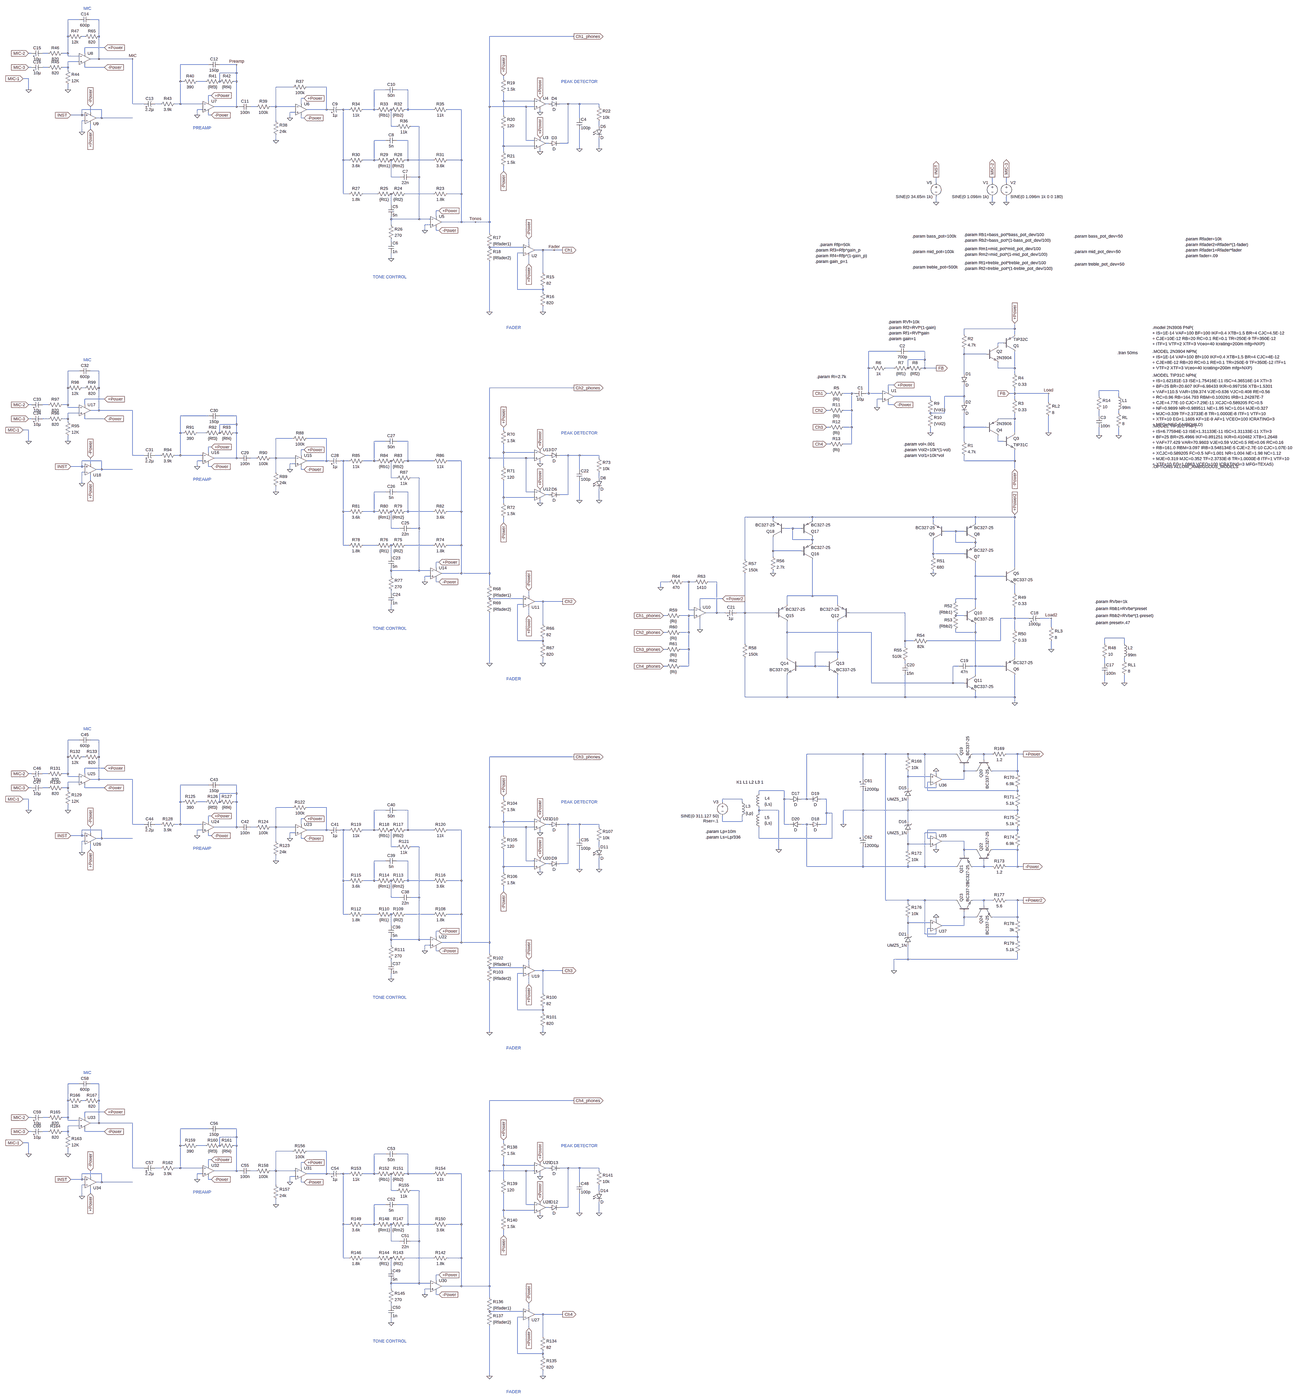
[diagram p0: schematic Project with supply.asc, whole sheet]
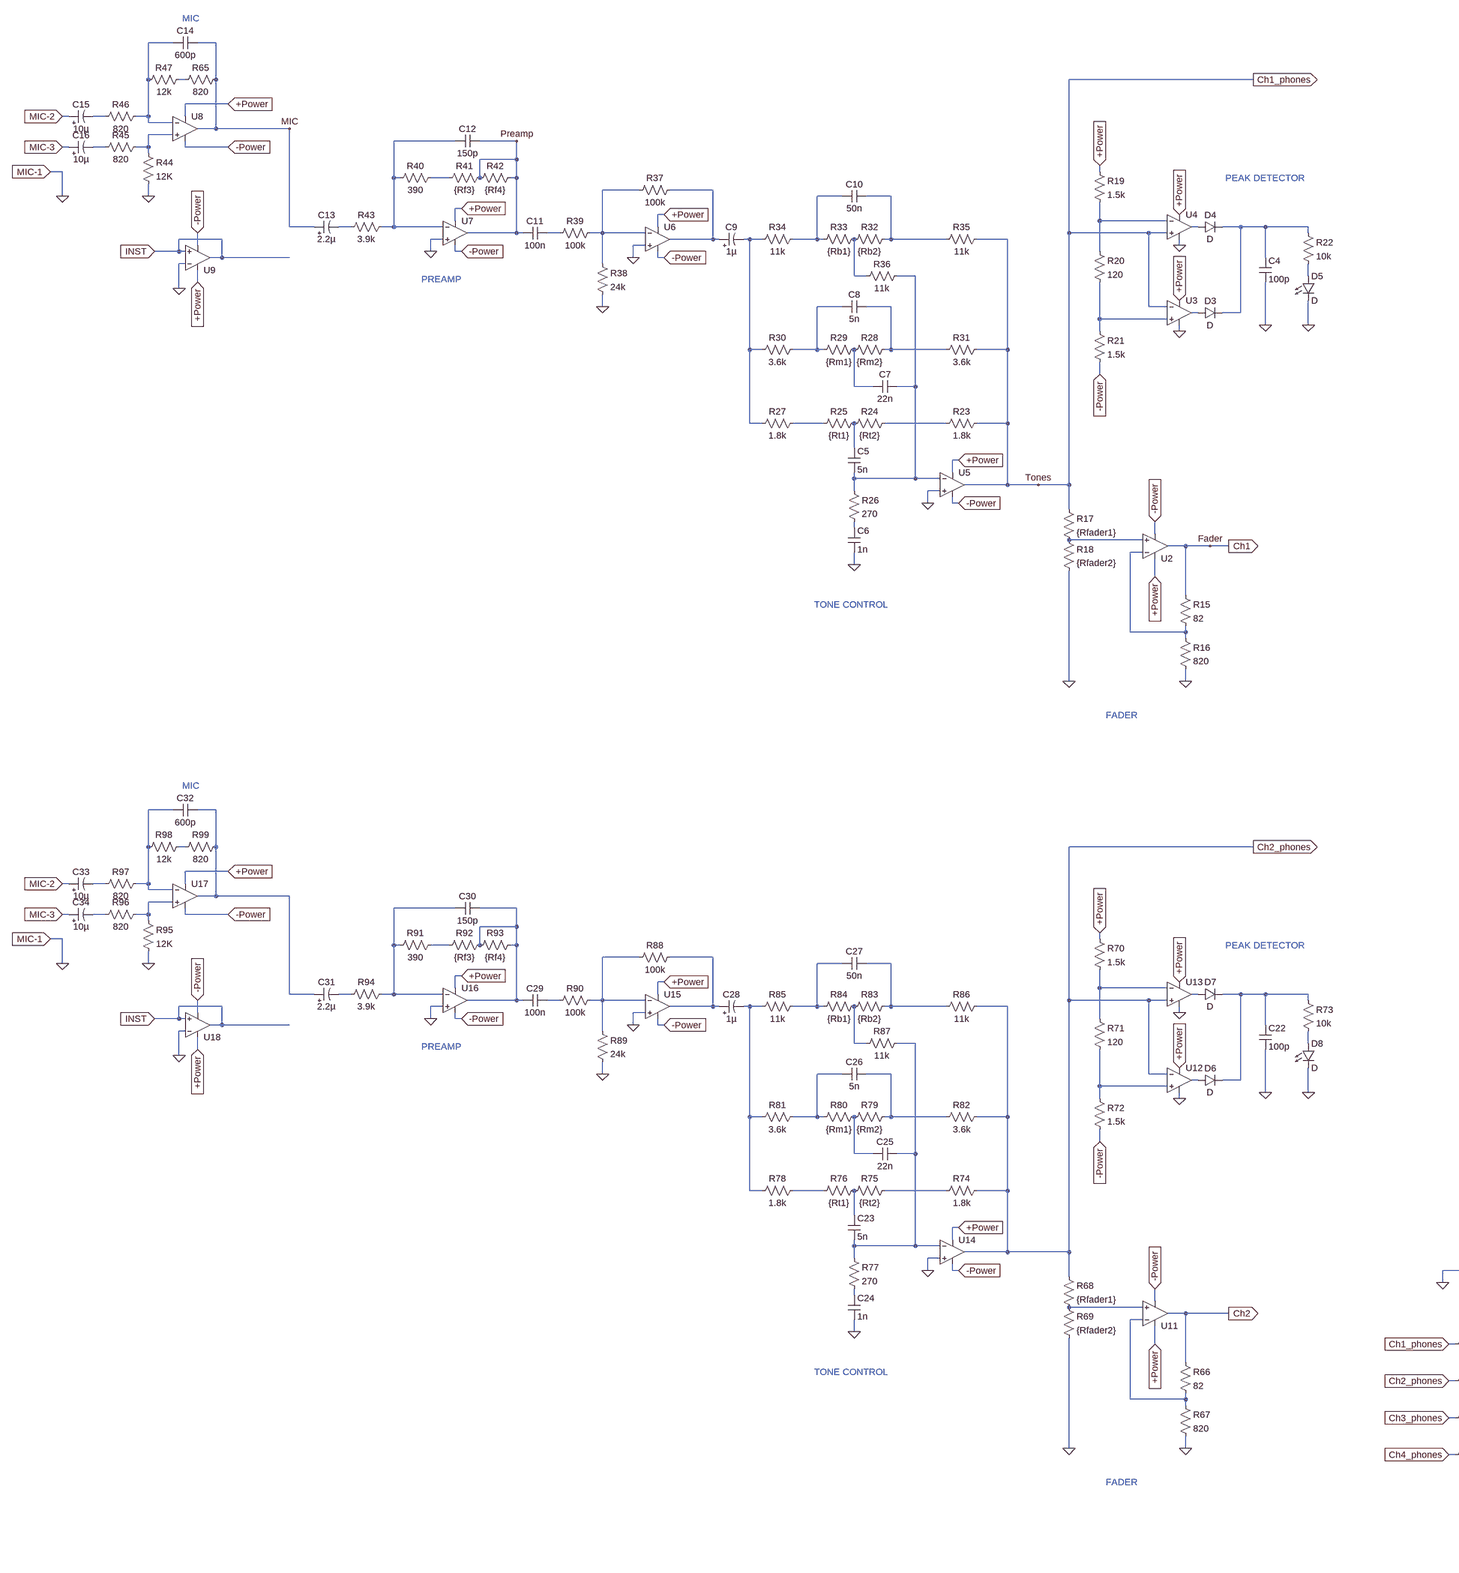
[diagram p1: schematic Project with supply.asc, part, row 1 of 2, column 1 of 2]
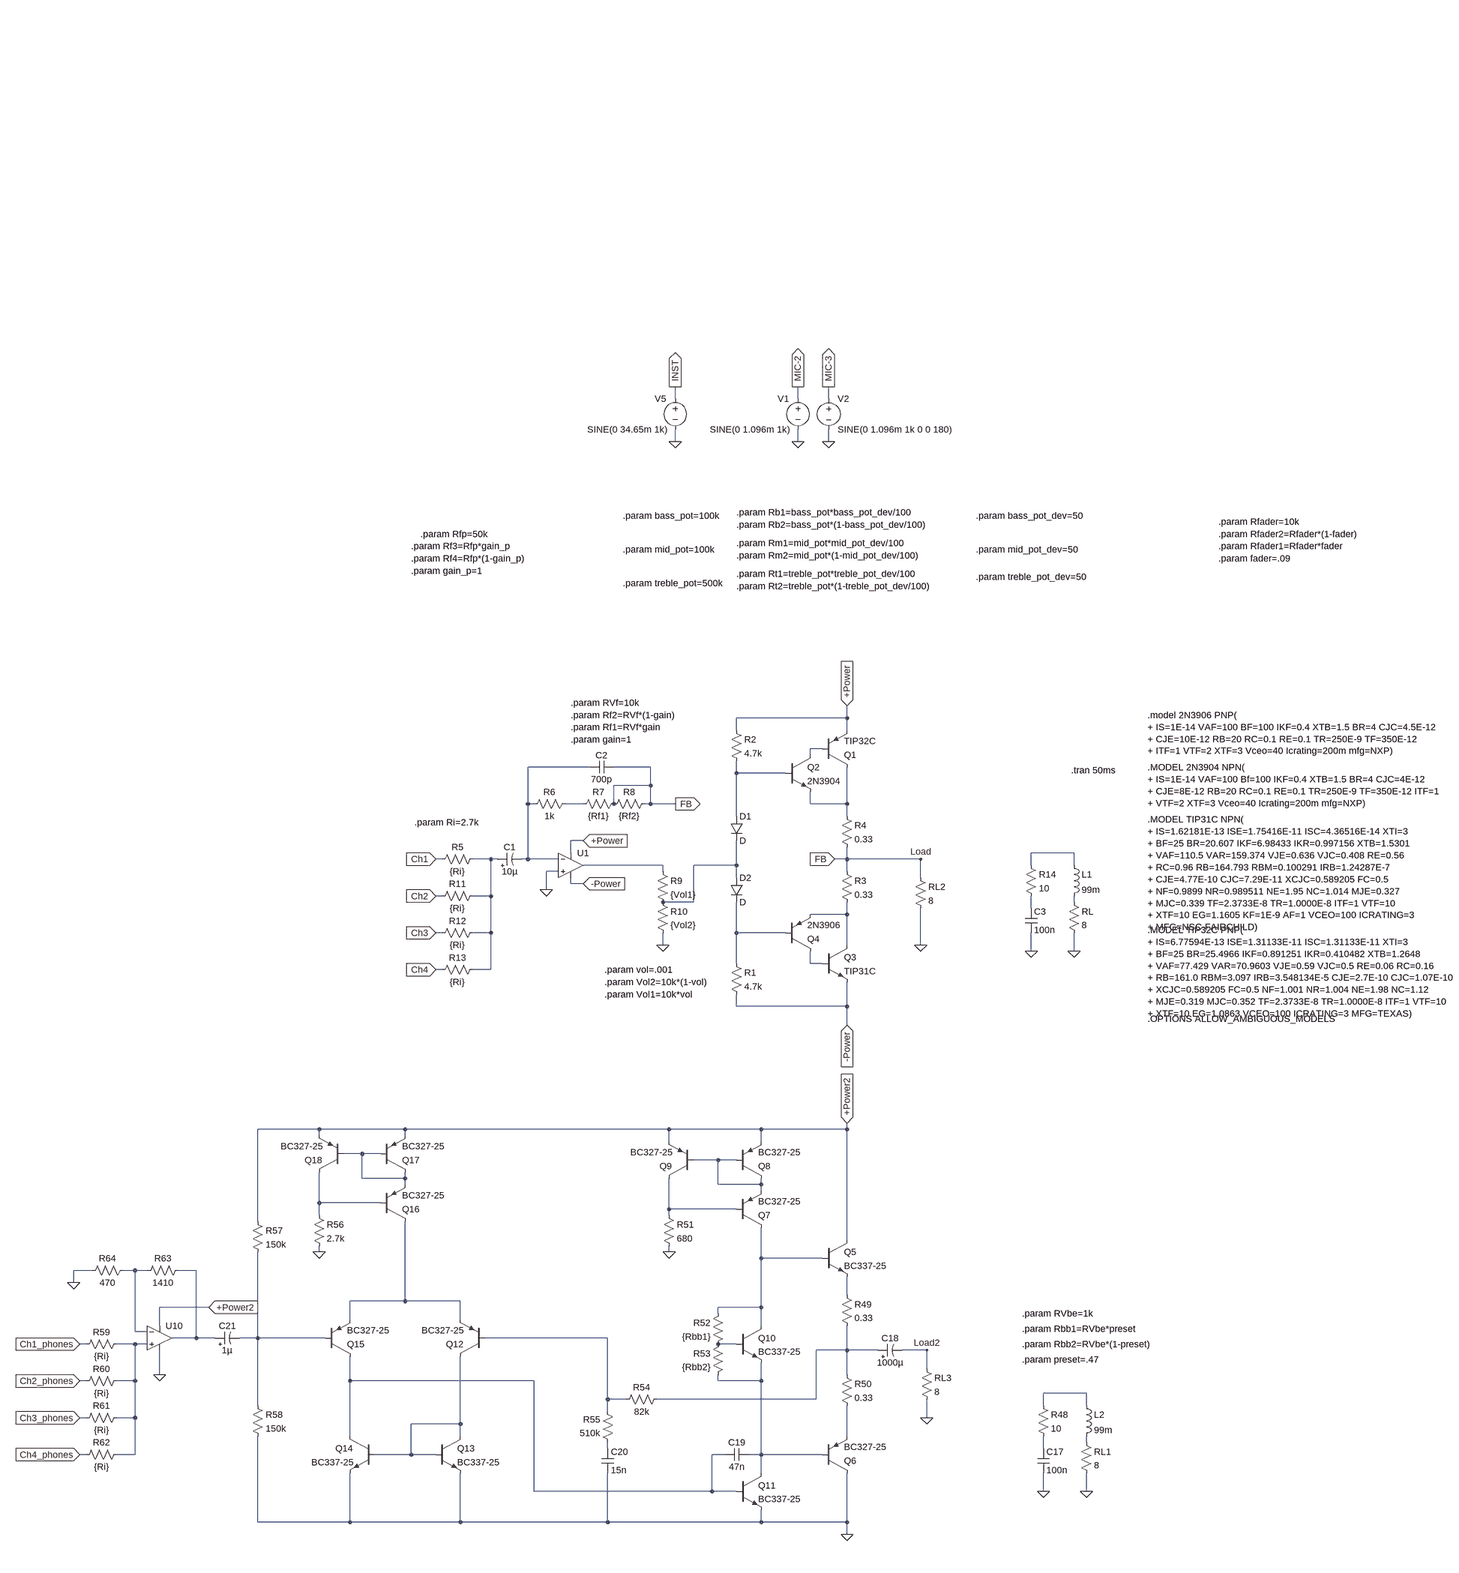
[diagram p2: schematic Project with supply.asc, part, row 1 of 2, column 2 of 2]
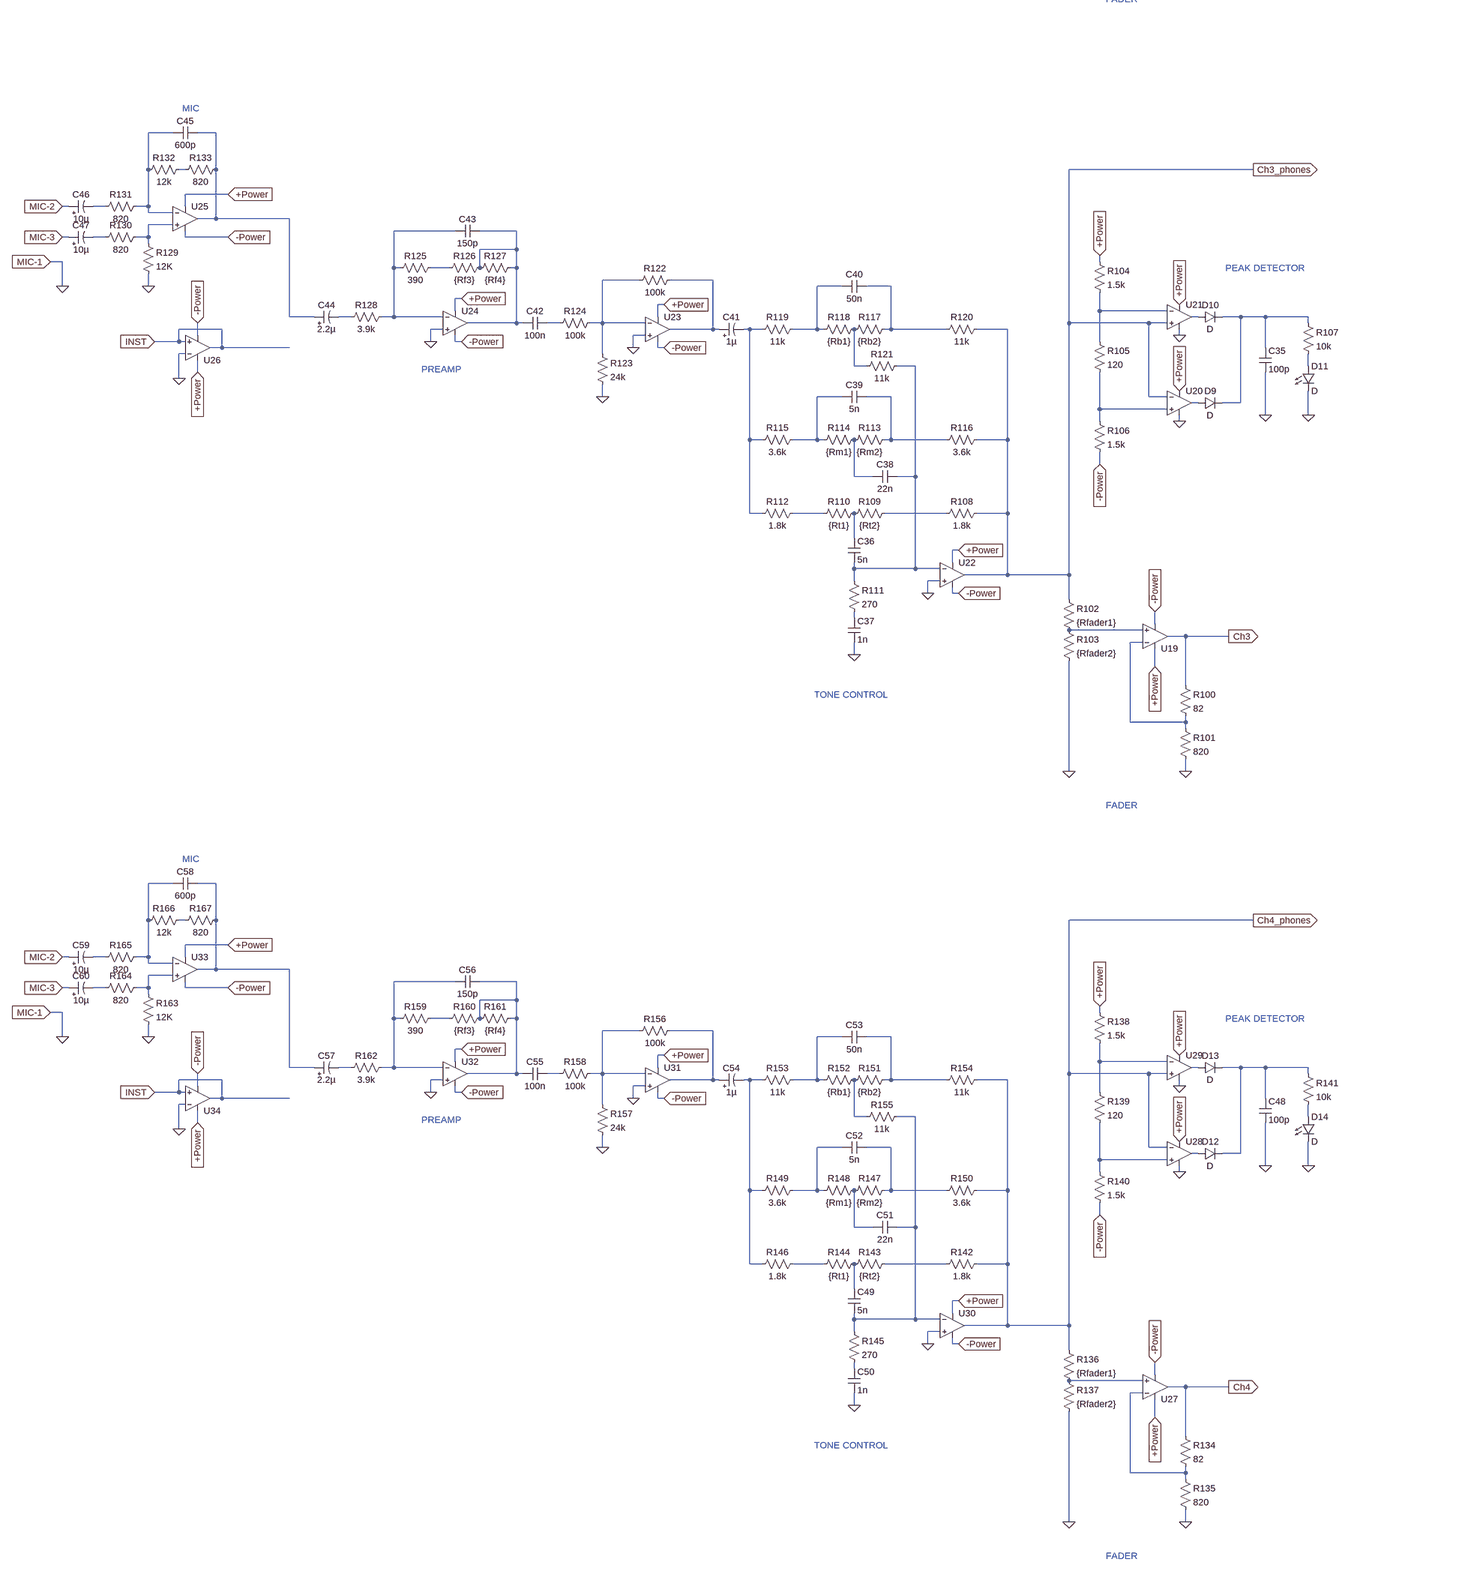
[diagram p3: schematic Project with supply.asc, part, row 2 of 2, column 1 of 2]
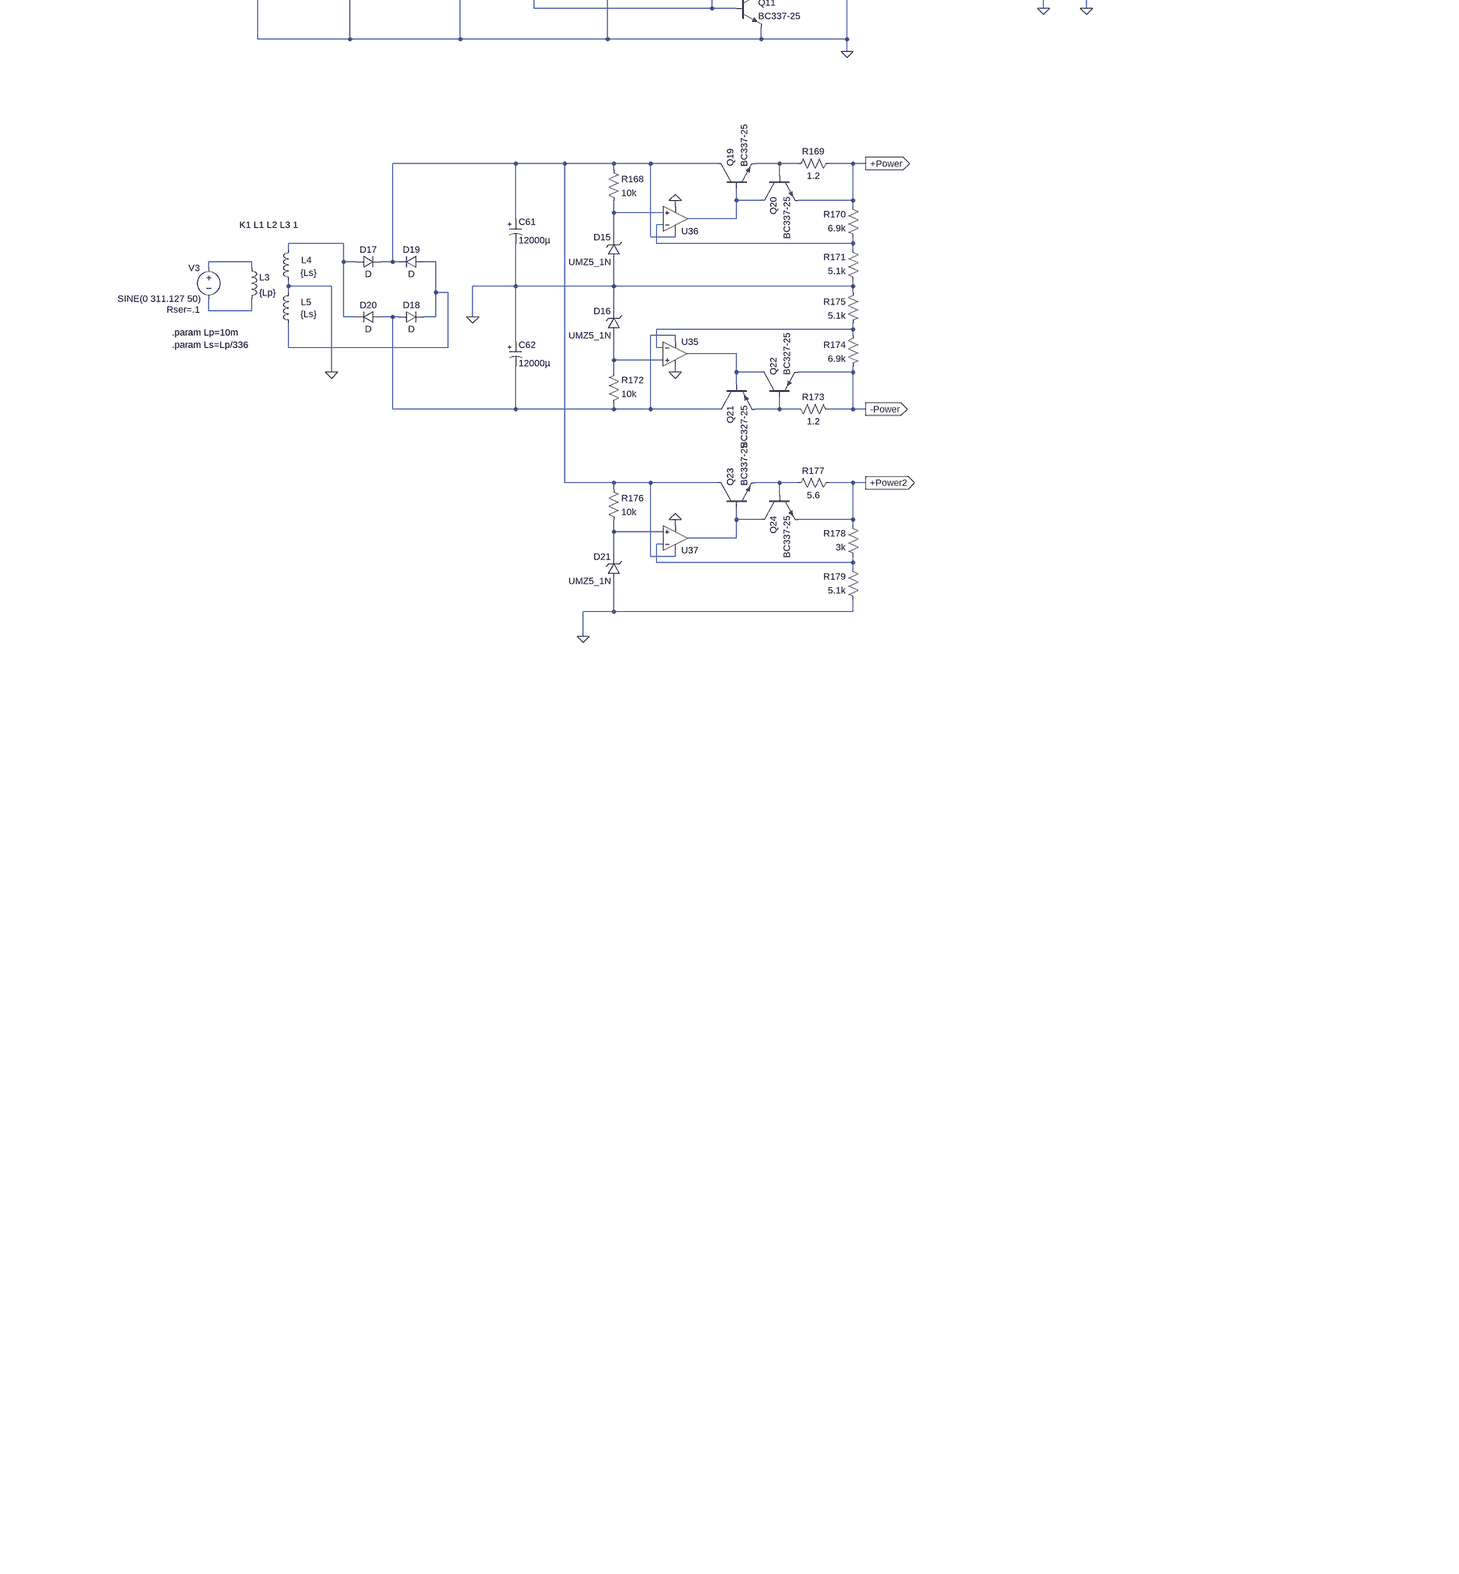
[diagram p4: schematic Project with supply.asc, part, row 2 of 2, column 2 of 2]
* Project with supply.asc
Q2 N032 N034 N036 0 2N3904
Q3 N051 N058 -Power 0 TIP31C
Q4 N058 N052 N051 0 2N3906
D1 N034 N043 D
D2 N043 N052 D
R2 +Power N034 4.7k
RL N046 0 8
R1 N052 -Power 4.7k
R3 Load N051 0.33
R4 N036 Load 0.33
Q1 N036 N032 +Power 0 TIP32C
X§U1 0 N033 +Power -Power N042 level1 Avol=1Meg GBW=10Meg Vos=0 En=0 Enk=0 In=0 Ink=0 Rin=500Meg  ; pins In+ In- V+ V- OUT
R5 N041 Fader {Ri}
R6 N035 N033 1k
R7 Load N035 {Rf1}
R8 Load Load {Rf2}
R9 N042 N043 {Vol1}
R10 N043 0 {Vol2}
R11 N041 Ch2 {Ri}
R12 N041 Ch3 {Ri}
R13 N041 Ch4 {Ri}
C1 N041 N033 10µ
C2 Load N033 700p
L1 N040 N046 99m
R14 N040 N049 10
C3 N049 0 100n
X§U2 N030 N031 +Power -Power Fader level1 Avol=1Meg GBW=10Meg Vos=0 En=0 Enk=0 In=0 Ink=0 Rin=500Meg  ; pins In+ In- V+ V- OUT
R15 Fader N031 82
R16 N031 0 820
R17 Tones N030 {Rfader1}
R18 N030 0 {Rfader2}
X§U3 N024 Tones +Power 0 N023 level1 Avol=1Meg GBW=10Meg Vos=0 En=0 Enk=0 In=0 Ink=0 Rin=500Meg  ; pins In+ In- V+ V- OUT
D3 N023 N015 D
X§U4 Tones N012 +Power 0 N014 level1 Avol=1Meg GBW=10Meg Vos=0 En=0 Enk=0 In=0 Ink=0 Rin=500Meg  ; pins In+ In- V+ V- OUT
D4 N014 N015 D
R19 +Power N012 1.5k
R20 N012 N024 120
R21 N024 -Power 1.5k
R22 N015 N020 10k
D5 N020 0 D
X§U5 0 N019 +Power -Power Tones level1 Avol=1Meg GBW=10Meg Vos=0 En=0 Enk=0 In=0 Ink=0 Rin=500Meg  ; pins In+ In- V+ V- OUT
R23 Tones N027 1.8k
R24 N027 N028 {Rt2}
R25 N028 N026 {Rt1}
C5 N028 N019 5n
R26 N019 N029 270
C6 N029 0 1n
R27 N026 N017 1.8k
C7 N019 N025 22n
R28 N022 N025 {Rm2}
R29 N025 N021 {Rm1}
C8 N022 N021 5n
R30 N021 N017 3.6k
R31 Tones N022 3.6k
R32 N011 N018 {Rb2}
R33 N018 N010 {Rb1}
C10 N011 N010 50n
R34 N010 N017 11k
R35 Tones N011 11k
R36 N019 N018 11k
C9 N009 N017 1µ
X§U6 0 N008 +Power -Power N009 level1 Avol=1Meg GBW=10Meg Vos=0 En=0 Enk=0 In=0 Ink=0 Rin=500Meg  ; pins In+ In- V+ V- OUT
R37 N009 N008 100k
R38 N008 0 24k
R39 N008 N016 100k
C11 N016 Preamp 100n
X§U7 0 N005 +Power -Power Preamp level1 Avol=1Meg GBW=10Meg Vos=0 En=0 Enk=0 In=0 Ink=0 Rin=500Meg  ; pins In+ In- V+ V- OUT
R40 N007 N005 390
R41 Preamp N007 {Rf3}
R42 Preamp Preamp {Rf4}
C12 Preamp N005 150p
R43 N005 N013 3.9k
C13 MIC N013 2.2µ
X§U8 N004 N001 +Power -Power MIC level1 Avol=1Meg GBW=10Meg Vos=0 En=0 Enk=0 In=0 Ink=0 Rin=500Meg  ; pins In+ In- V+ V- OUT
R44 N004 0 12K
R45 N004 N006 820
R46 N001 N003 820
C14 MIC N001 600p
C15 MIC-2 N003 10µ
C16 MIC-3 N006 10µ
V1 MIC-2 0 SINE(0 1.096m 1k)
V2 MIC-3 0 SINE(0 1.096m 1k 0 0 180)
X§U9 INST 0 +Power -Power INST level1 Avol=1Meg GBW=10Meg Vos=0 En=0 Enk=0 In=0 Ink=0 Rin=500Meg  ; pins In+ In- V+ V- OUT
V5 INST 0 SINE(0 34.65m 1k)
RL1 N098 0 8
L2 N095 N098 99m
R48 N095 N100 10
C17 N100 0 100n
C18 N092 Load2 1000µ
R49 N084 N092 0.33
R50 N092 N097 0.33
Q5 +Power2 N080 N084 0 BC337-25
Q6 0 N094 N097 0 BC327-25
Q7 N080 N078 N074 0 BC327-25
Q8 N074 N074 +Power2 0 BC327-25
Q9 N078 N074 +Power2 0 BC327-25
R51 N078 0 680
Q10 N080 N091 N094 0 BC337-25
R52 N080 N091 {Rbb1}
R53 N091 N094 {Rbb2}
Q11 N094 N093 0 0 BC337-25
C19 N094 N093 47n
R54 N092 N089 82k
R55 N099 N089 510k
C20 N099 0 15n
Q12 N096 N089 N085 0 BC327-25
Q13 N096 N096 0 0 BC337-25
Q14 N093 N096 0 0 BC337-25
Q15 N093 N088 N085 0 BC327-25
Q16 N085 N077 N073 0 BC327-25
Q17 N073 N073 +Power2 0 BC327-25
Q18 N077 N073 +Power2 0 BC327-25
R56 N077 0 2.7k
R57 +Power2 N088 150k
R58 N088 0 150k
X§U10 N090 N081 +Power2 0 N082 level1 Avol=1Meg GBW=10Meg Vos=0 En=0 Enk=0 In=0 Ink=0 Rin=500Meg  ; pins In+ In- V+ V- OUT
R59 N090 Tones {Ri}
R60 N090 Ch2_phones {Ri}
R61 N090 Ch3_phones {Ri}
R62 N090 Ch4_phones {Ri}
C21 N082 N088 1µ
R63 N082 N081 1410
R64 N081 0 470
RL2 Load 0 8
RL3 Load2 0 8
R47 N002 N001 12k
R65 MIC N002 820
X§U11 N086 N087 +Power -Power Ch2 level1 Avol=1Meg GBW=10Meg Vos=0 En=0 Enk=0 In=0 Ink=0 Rin=500Meg  ; pins In+ In- V+ V- OUT
R66 Ch2 N087 82
R67 N087 0 820
R68 Ch2_phones N086 {Rfader1}
R69 N086 0 {Rfader2}
X§U12 N071 Ch2_phones +Power 0 N070 level1 Avol=1Meg GBW=10Meg Vos=0 En=0 Enk=0 In=0 Ink=0 Rin=500Meg  ; pins In+ In- V+ V- OUT
D6 N070 N062 D
X§U13 Ch2_phones N059 +Power 0 N061 level1 Avol=1Meg GBW=10Meg Vos=0 En=0 Enk=0 In=0 Ink=0 Rin=500Meg  ; pins In+ In- V+ V- OUT
D7 N061 N062 D
R70 +Power N059 1.5k
R71 N059 N071 120
R72 N071 -Power 1.5k
R73 N062 N067 10k
D8 N067 0 D
X§U14 0 N066 +Power -Power Ch2_phones level1 Avol=1Meg GBW=10Meg Vos=0 En=0 Enk=0 In=0 Ink=0 Rin=500Meg  ; pins In+ In- V+ V- OUT
R74 Ch2_phones N076 1.8k
R75 N076 N079 {Rt2}
R76 N079 N075 {Rt1}
C23 N079 N066 5n
R77 N066 N083 270
C24 N083 0 1n
R78 N075 N064 1.8k
C25 N066 N072 22n
R79 N069 N072 {Rm2}
R80 N072 N068 {Rm1}
C26 N069 N068 5n
R81 N068 N064 3.6k
R82 Ch2_phones N069 3.6k
R83 N057 N065 {Rb2}
R84 N065 N056 {Rb1}
C27 N057 N056 50n
R85 N056 N064 11k
R86 Ch2_phones N057 11k
R87 N066 N065 11k
C28 N055 N064 1µ
X§U15 0 N054 +Power -Power N055 level1 Avol=1Meg GBW=10Meg Vos=0 En=0 Enk=0 In=0 Ink=0 Rin=500Meg  ; pins In+ In- V+ V- OUT
R88 N055 N054 100k
R89 N054 0 24k
R90 N054 N063 100k
C29 N063 N048 100n
X§U16 0 N047 +Power -Power N048 level1 Avol=1Meg GBW=10Meg Vos=0 En=0 Enk=0 In=0 Ink=0 Rin=500Meg  ; pins In+ In- V+ V- OUT
R91 N053 N047 390
R92 N048 N053 {Rf3}
R93 N048 N048 {Rf4}
C30 N048 N047 150p
R94 N047 N060 3.9k
C31 N038 N060 2.2µ
X§U17 N045 N037 +Power -Power N038 level1 Avol=1Meg GBW=10Meg Vos=0 En=0 Enk=0 In=0 Ink=0 Rin=500Meg  ; pins In+ In- V+ V- OUT
R95 N045 0 12K
R96 N045 N050 820
R97 N037 N044 820
C32 N038 N037 600p
C33 MIC-2 N044 10µ
C34 MIC-3 N050 10µ
X§U18 INST 0 +Power -Power INST level1 Avol=1Meg GBW=10Meg Vos=0 En=0 Enk=0 In=0 Ink=0 Rin=500Meg  ; pins In+ In- V+ V- OUT
R98 N039 N037 12k
R99 N038 N039 820
X§U19 N150 N151 +Power -Power Ch3 level1 Avol=1Meg GBW=10Meg Vos=0 En=0 Enk=0 In=0 Ink=0 Rin=500Meg  ; pins In+ In- V+ V- OUT
R100 Ch3 N151 82
R101 N151 0 820
R102 Ch3_phones N150 {Rfader1}
R103 N150 0 {Rfader2}
X§U20 N139 Ch3_phones +Power 0 N138 level1 Avol=1Meg GBW=10Meg Vos=0 En=0 Enk=0 In=0 Ink=0 Rin=500Meg  ; pins In+ In- V+ V- OUT
D9 N138 N126 D
X§U21 Ch3_phones N122 +Power 0 N125 level1 Avol=1Meg GBW=10Meg Vos=0 En=0 Enk=0 In=0 Ink=0 Rin=500Meg  ; pins In+ In- V+ V- OUT
D10 N125 N126 D
R104 +Power N122 1.5k
R105 N122 N139 120
R106 N139 -Power 1.5k
R107 N126 N135 10k
D11 N135 0 D
X§U22 0 N134 +Power -Power Ch3_phones level1 Avol=1Meg GBW=10Meg Vos=0 En=0 Enk=0 In=0 Ink=0 Rin=500Meg  ; pins In+ In- V+ V- OUT
R108 Ch3_phones N144 1.8k
R109 N144 N147 {Rt2}
R110 N147 N143 {Rt1}
C36 N147 N134 5n
R111 N134 N149 270
C37 N149 0 1n
R112 N143 N129 1.8k
C38 N134 N141 22n
R113 N137 N141 {Rm2}
R114 N141 N136 {Rm1}
C39 N137 N136 5n
R115 N136 N129 3.6k
R116 Ch3_phones N137 3.6k
R117 N121 N133 {Rb2}
R118 N133 N120 {Rb1}
C40 N121 N120 50n
R119 N120 N129 11k
R120 Ch3_phones N121 11k
R121 N134 N133 11k
C41 N119 N129 1µ
X§U23 0 N118 +Power -Power N119 level1 Avol=1Meg GBW=10Meg Vos=0 En=0 Enk=0 In=0 Ink=0 Rin=500Meg  ; pins In+ In- V+ V- OUT
R122 N119 N118 100k
R123 N118 0 24k
R124 N118 N128 100k
C42 N128 N112 100n
X§U24 0 N111 +Power -Power N112 level1 Avol=1Meg GBW=10Meg Vos=0 En=0 Enk=0 In=0 Ink=0 Rin=500Meg  ; pins In+ In- V+ V- OUT
R125 N117 N111 390
R126 N112 N117 {Rf3}
R127 N112 N112 {Rf4}
C43 N112 N111 150p
R128 N111 N124 3.9k
C44 N102 N124 2.2µ
X§U25 N109 N101 +Power -Power N102 level1 Avol=1Meg GBW=10Meg Vos=0 En=0 Enk=0 In=0 Ink=0 Rin=500Meg  ; pins In+ In- V+ V- OUT
R129 N109 0 12K
R130 N109 N113 820
R131 N101 N107 820
C45 N102 N101 600p
C46 MIC-2 N107 10µ
C47 MIC-3 N113 10µ
X§U26 INST 0 +Power -Power INST level1 Avol=1Meg GBW=10Meg Vos=0 En=0 Enk=0 In=0 Ink=0 Rin=500Meg  ; pins In+ In- V+ V- OUT
R132 N105 N101 12k
R133 N102 N105 820
X§U27 N183 N184 +Power -Power Ch4 level1 Avol=1Meg GBW=10Meg Vos=0 En=0 Enk=0 In=0 Ink=0 Rin=500Meg  ; pins In+ In- V+ V- OUT
R134 Ch4 N184 82
R135 N184 0 820
R136 Ch4_phones N183 {Rfader1}
R137 N183 0 {Rfader2}
X§U28 N177 Ch4_phones +Power 0 N176 level1 Avol=1Meg GBW=10Meg Vos=0 En=0 Enk=0 In=0 Ink=0 Rin=500Meg  ; pins In+ In- V+ V- OUT
D12 N176 N168 D
X§U29 Ch4_phones N165 +Power 0 N167 level1 Avol=1Meg GBW=10Meg Vos=0 En=0 Enk=0 In=0 Ink=0 Rin=500Meg  ; pins In+ In- V+ V- OUT
D13 N167 N168 D
R138 +Power N165 1.5k
R139 N165 N177 120
R140 N177 -Power 1.5k
R141 N168 N173 10k
D14 N173 0 D
X§U30 0 N172 +Power -Power Ch4_phones level1 Avol=1Meg GBW=10Meg Vos=0 En=0 Enk=0 In=0 Ink=0 Rin=500Meg  ; pins In+ In- V+ V- OUT
R142 Ch4_phones N180 1.8k
R143 N180 N181 {Rt2}
R144 N181 N179 {Rt1}
C49 N181 N172 5n
R145 N172 N182 270
C50 N182 0 1n
R146 N179 N170 1.8k
C51 N172 N178 22n
R147 N175 N178 {Rm2}
R148 N178 N174 {Rm1}
C52 N175 N174 5n
R149 N174 N170 3.6k
R150 Ch4_phones N175 3.6k
R151 N164 N171 {Rb2}
R152 N171 N163 {Rb1}
C53 N164 N163 50n
R153 N163 N170 11k
R154 Ch4_phones N164 11k
R155 N172 N171 11k
C54 N162 N170 1µ
X§U31 0 N161 +Power -Power N162 level1 Avol=1Meg GBW=10Meg Vos=0 En=0 Enk=0 In=0 Ink=0 Rin=500Meg  ; pins In+ In- V+ V- OUT
R156 N162 N161 100k
R157 N161 0 24k
R158 N161 N169 100k
C55 N169 N158 100n
X§U32 0 N157 +Power -Power N158 level1 Avol=1Meg GBW=10Meg Vos=0 En=0 Enk=0 In=0 Ink=0 Rin=500Meg  ; pins In+ In- V+ V- OUT
R159 N160 N157 390
R160 N158 N160 {Rf3}
R161 N158 N158 {Rf4}
C56 N158 N157 150p
R162 N157 N166 3.9k
C57 N153 N166 2.2µ
X§U33 N156 N152 +Power -Power N153 level1 Avol=1Meg GBW=10Meg Vos=0 En=0 Enk=0 In=0 Ink=0 Rin=500Meg  ; pins In+ In- V+ V- OUT
R163 N156 0 12K
R164 N156 N159 820
R165 N152 N155 820
C58 N153 N152 600p
C59 MIC-2 N155 10µ
C60 MIC-3 N159 10µ
X§U34 INST 0 +Power -Power INST level1 Avol=1Meg GBW=10Meg Vos=0 En=0 Enk=0 In=0 Ink=0 Rin=500Meg  ; pins In+ In- V+ V- OUT
R166 N154 N152 12k
R167 N153 N154 820
X§U36 N108 N110 N103 0 N106 level1 Avol=1Meg GBW=10Meg Vos=0 En=0 Enk=0 In=0 Ink=0 Rin=500Meg  ; pins In+ In- V+ V- OUT
R168 N103 N108 10k
D15 0 N108 UMZ5_1N
Q19 N103 N106 N104 0 BC337-25
Q20 N106 N104 +Power 0 BC337-25
Q21 N127 N131 N140 0 BC327-25
Q22 N131 N140 -Power 0 BC327-25
R169 +Power N104 1.2
R170 N110 +Power 6.9k
R171 0 N110 5.1k
X§U35 N132 N130 N127 0 N131 level1 Avol=1Meg GBW=10Meg Vos=0 En=0 Enk=0 In=0 Ink=0 Rin=500Meg  ; pins In+ In- V+ V- OUT
R172 N127 N132 10k
D16 N132 0 UMZ5_1N
R173 -Power N140 1.2
R174 N130 -Power 6.9k
R175 0 N130 5.1k
C61 N103 0 12000µ
C62 0 N127 12000µ
D17 N114 N103 D
D18 N127 N116 D
D19 N116 N103 D
D20 N127 N114 D
L3 N115 N123 {Lp}
L4 0 N114 {Ls}
L5 N116 0 {Ls}
V3 N115 N123 SINE(0 311.127 50) Rser=.1
C4 N015 0 100p
C22 N062 0 100p
C35 N126 0 100p
C48 N168 0 100p
X§U37 N146 N148 N103 0 N145 level1 Avol=1Meg GBW=10Meg Vos=0 En=0 Enk=0 In=0 Ink=0 Rin=500Meg  ; pins In+ In- V+ V- OUT
R176 N103 N146 10k
D21 0 N146 UMZ5_1N
Q23 N103 N145 N142 0 BC337-25
Q24 N145 N142 +Power2 0 BC337-25
R177 +Power2 N142 5.6
R178 N148 +Power2 3k
R179 0 N148 5.1k
.model D D
.lib standard.dio
.model NPN NPN
.model PNP PNP
.lib standard.bjt
.tran 50ms
.MODEL 2N3904 NPN(
+ IS=1E-14 VAF=100 Bf=100 IKF=0.4 XTB=1.5 BR=4 CJC=4E-12
+ CJE=8E-12 RB=20 RC=0.1 RE=0.1 TR=250E-9 TF=350E-12 ITF=1
+ VTF=2 XTF=3 Vceo=40 Icrating=200m mfg=NXP)
.MODEL TIP31C NPN(
+ IS=1.62181E-13 ISE=1.75416E-11 ISC=4.36516E-14 XTI=3
+ BF=25 BR=20.607 IKF=6.98433 IKR=0.997156 XTB=1.5301
+ VAF=110.5 VAR=159.374 VJE=0.636 VJC=0.408 RE=0.56
+ RC=0.96 RB=164.793 RBM=0.100291 IRB=1.24287E-7
+ CJE=4.77E-10 CJC=7.29E-11 XCJC=0.589205 FC=0.5
+ NF=0.9899 NR=0.989511 NE=1.95 NC=1.014 MJE=0.327
+ MJC=0.339 TF=2.3733E-8 TR=1.0000E-8 ITF=1 VTF=10
+ XTF=10 EG=1.1605 KF=1E-9 AF=1 VCEO=100 ICRATING=3
+ MFG=NSC-FAIRCHILD)
.model 2N3906 PNP(
+ IS=1E-14 VAF=100 BF=100 IKF=0.4 XTB=1.5 BR=4 CJC=4.5E-12
+ CJE=10E-12 RB=20 RC=0.1 RE=0.1 TR=250E-9 TF=350E-12
+ ITF=1 VTF=2 XTF=3 Vceo=40 Icrating=200m mfg=NXP)
.MODEL TIP32C PNP(
+ IS=6.77594E-13 ISE=1.31133E-11 ISC=1.31133E-11 XTI=3
+ BF=25 BR=25.4966 IKF=0.891251 IKR=0.410482 XTB=1.2648
+ VAF=77.429 VAR=70.9603 VJE=0.59 VJC=0.5 RE=0.06 RC=0.16
+ RB=161.0 RBM=3.097 IRB=3.548134E-5 CJE=2.7E-10 CJC=1.07E-10
+ XCJC=0.589205 FC=0.5 NF=1.001 NR=1.004 NE=1.98 NC=1.12
+ MJE=0.319 MJC=0.352 TF=2.3733E-8 TR=1.0000E-8 ITF=1 VTF=10
+ XTF=10 EG=1.0863 VCEO=100 ICRATING=3 MFG=TEXAS)
.param vol=.001
.param gain=1
.param Rf1=RVf*gain
.param Rf2=RVf*(1-gain)
.param Vol1=10k*vol
.param Vol2=10k*(1-vol)
.OPTIONS ALLOW_AMBIGUOUS_MODELS
.param RVf=10k
.param Ri=2.7k
.param fader=.09
.param Rfader1=Rfader*fader
.param Rfader2=Rfader*(1-fader)
.param Rfader=10k
.param Rb1=bass_pot*bass_pot_dev/100
.param Rb2=bass_pot*(1-bass_pot_dev/100)
.param Rm1=mid_pot*mid_pot_dev/100
.param Rm2=mid_pot*(1-mid_pot_dev/100)
.param Rt1=treble_pot*treble_pot_dev/100
.param Rt2=treble_pot*(1-treble_pot_dev/100)
.param bass_pot=100k
.param mid_pot=100k
.param treble_pot=500k
.param bass_pot_dev=50
.param mid_pot_dev=50
.param treble_pot_dev=50
.param Rfp=50k
.param Rf3=Rfp*gain_p
.param Rf4=Rfp*(1-gain_p)
.param gain_p=1
* MIC
* PREAMP
* TONE CONTROL
* FADER
* PEAK DETECTOR
.param RVbe=1k
.param Rbb1=RVbe*preset
.param Rbb2=RVbe*(1-preset)
.param preset=.47
* MIC
* PREAMP
* TONE CONTROL
* FADER
* PEAK DETECTOR
* MIC
* PREAMP
* TONE CONTROL
* FADER
* PEAK DETECTOR
* MIC
* PREAMP
* TONE CONTROL
* FADER
* PEAK DETECTOR
K1 L1 L2 L3 1
.param Lp=10m
.param Ls=Lp/336
.lib UniversalOpAmp1.lib
.backanno
.end